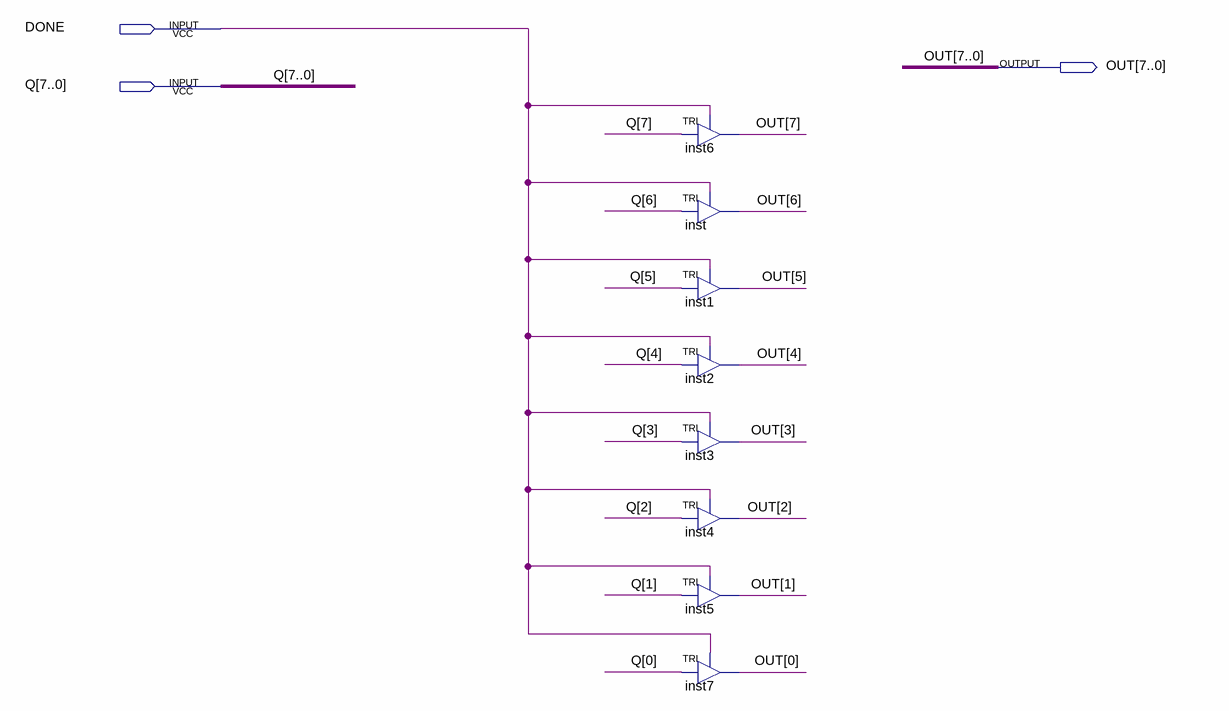
[diagram p0: schematic sheet]
// Quartus schematic TRI_STATE.bdf as structural Verilog: 8 symbols, 3 pins
module TRI_STATE (
  input  DONE,
  input  [7:0] Q,
  output [7:0] OUT
);

  TRI inst6 (.IN(Q[7]), .OE(DONE), .OUT(OUT[7]));
  TRI inst (.IN(Q[6]), .OE(DONE), .OUT(OUT[6]));
  TRI inst1 (.IN(Q[5]), .OE(DONE), .OUT(OUT[5]));
  TRI inst2 (.IN(Q[4]), .OE(DONE), .OUT(OUT[4]));
  TRI inst3 (.IN(Q[3]), .OE(DONE), .OUT(OUT[3]));
  TRI inst4 (.IN(Q[2]), .OE(DONE), .OUT(OUT[2]));
  TRI inst5 (.IN(Q[1]), .OE(DONE), .OUT(OUT[1]));
  TRI inst7 (.IN(Q[0]), .OE(DONE), .OUT(OUT[0]));
endmodule
